# Altium schematic sheet STM32H733_PINOUT.SchDoc
size C; SheetNumber: 4; SheetTotal: 5
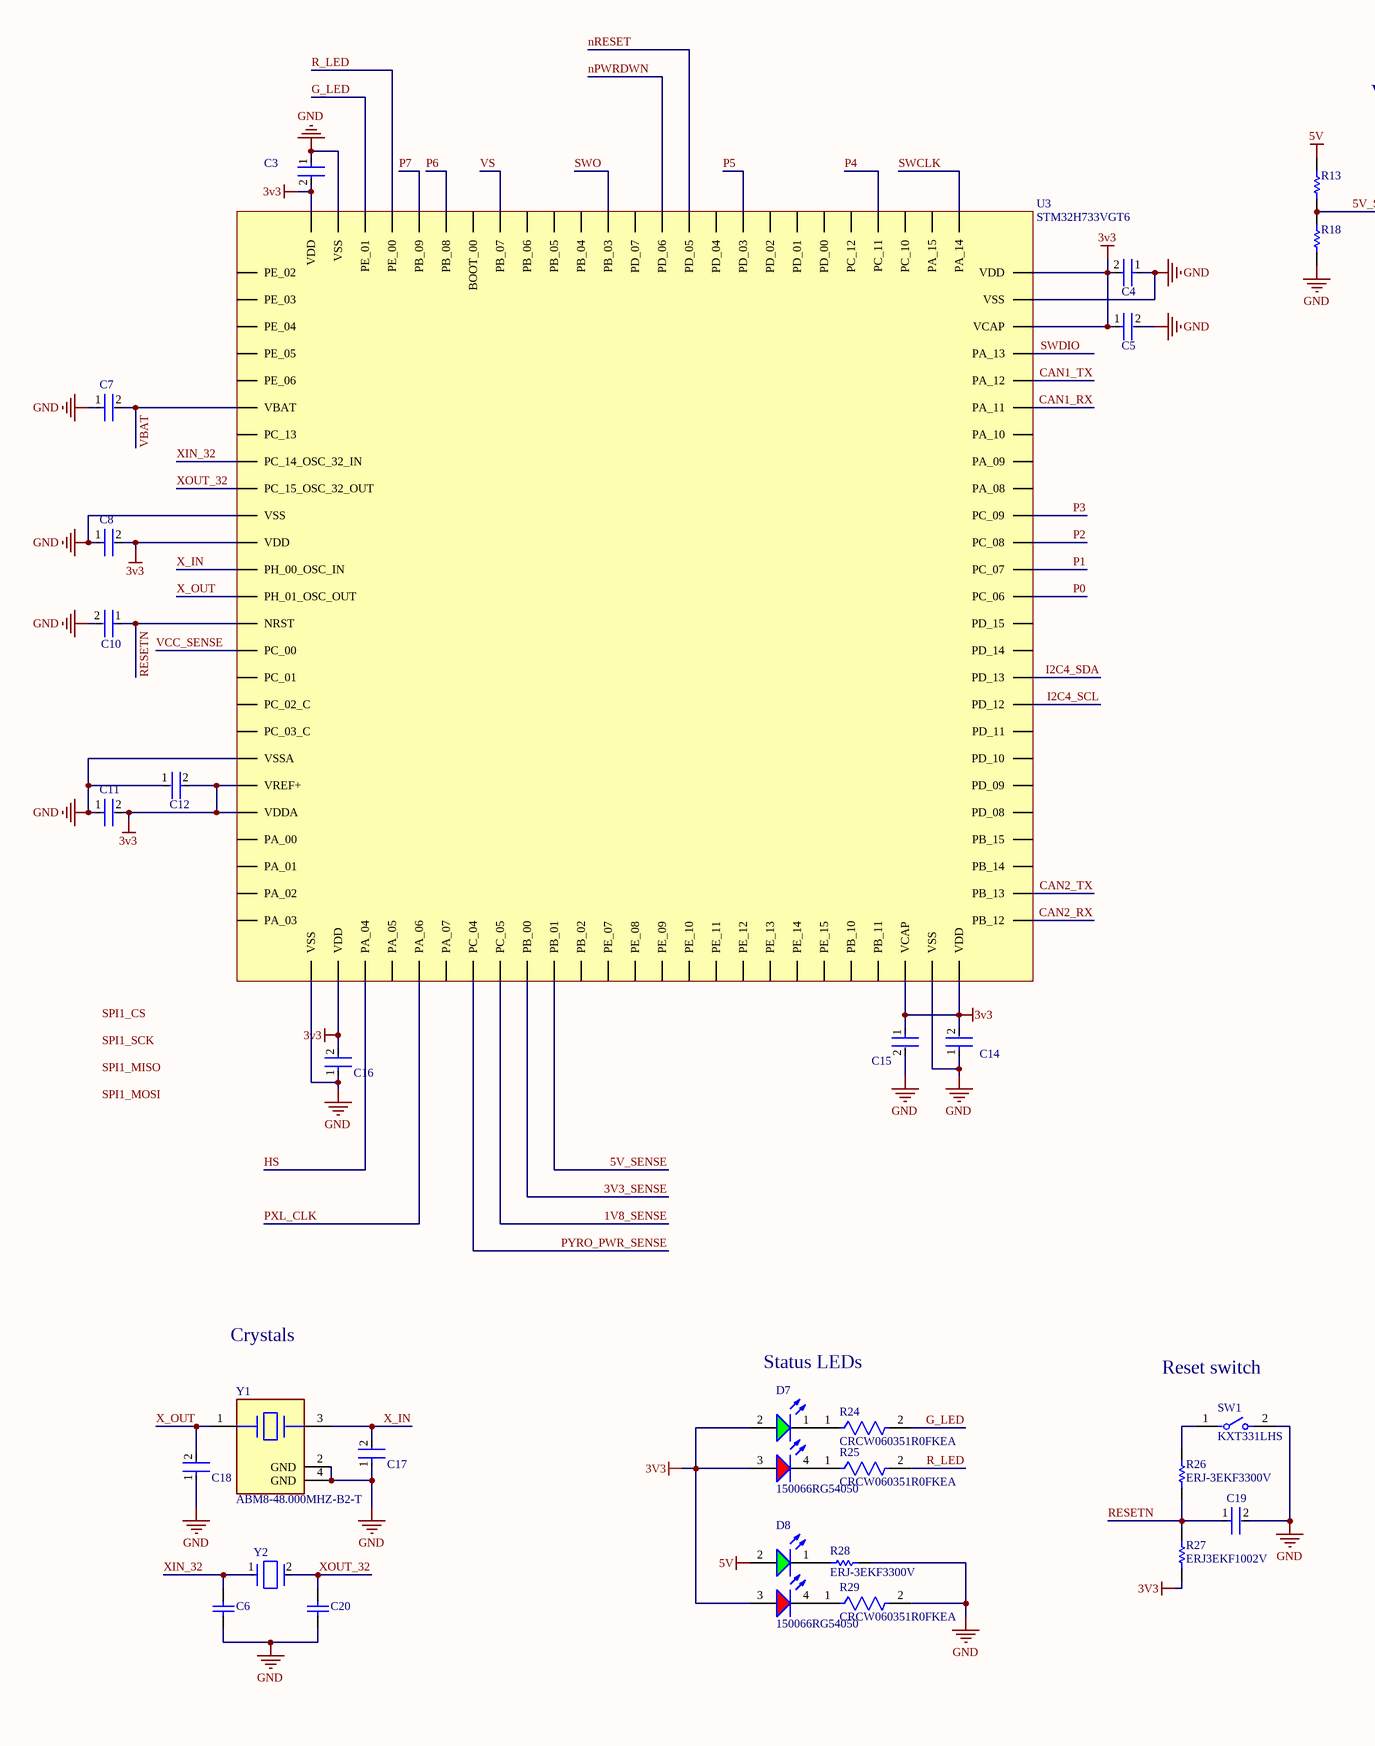
[diagram p0: STM32H733_PINOUT.SchDoc, left]
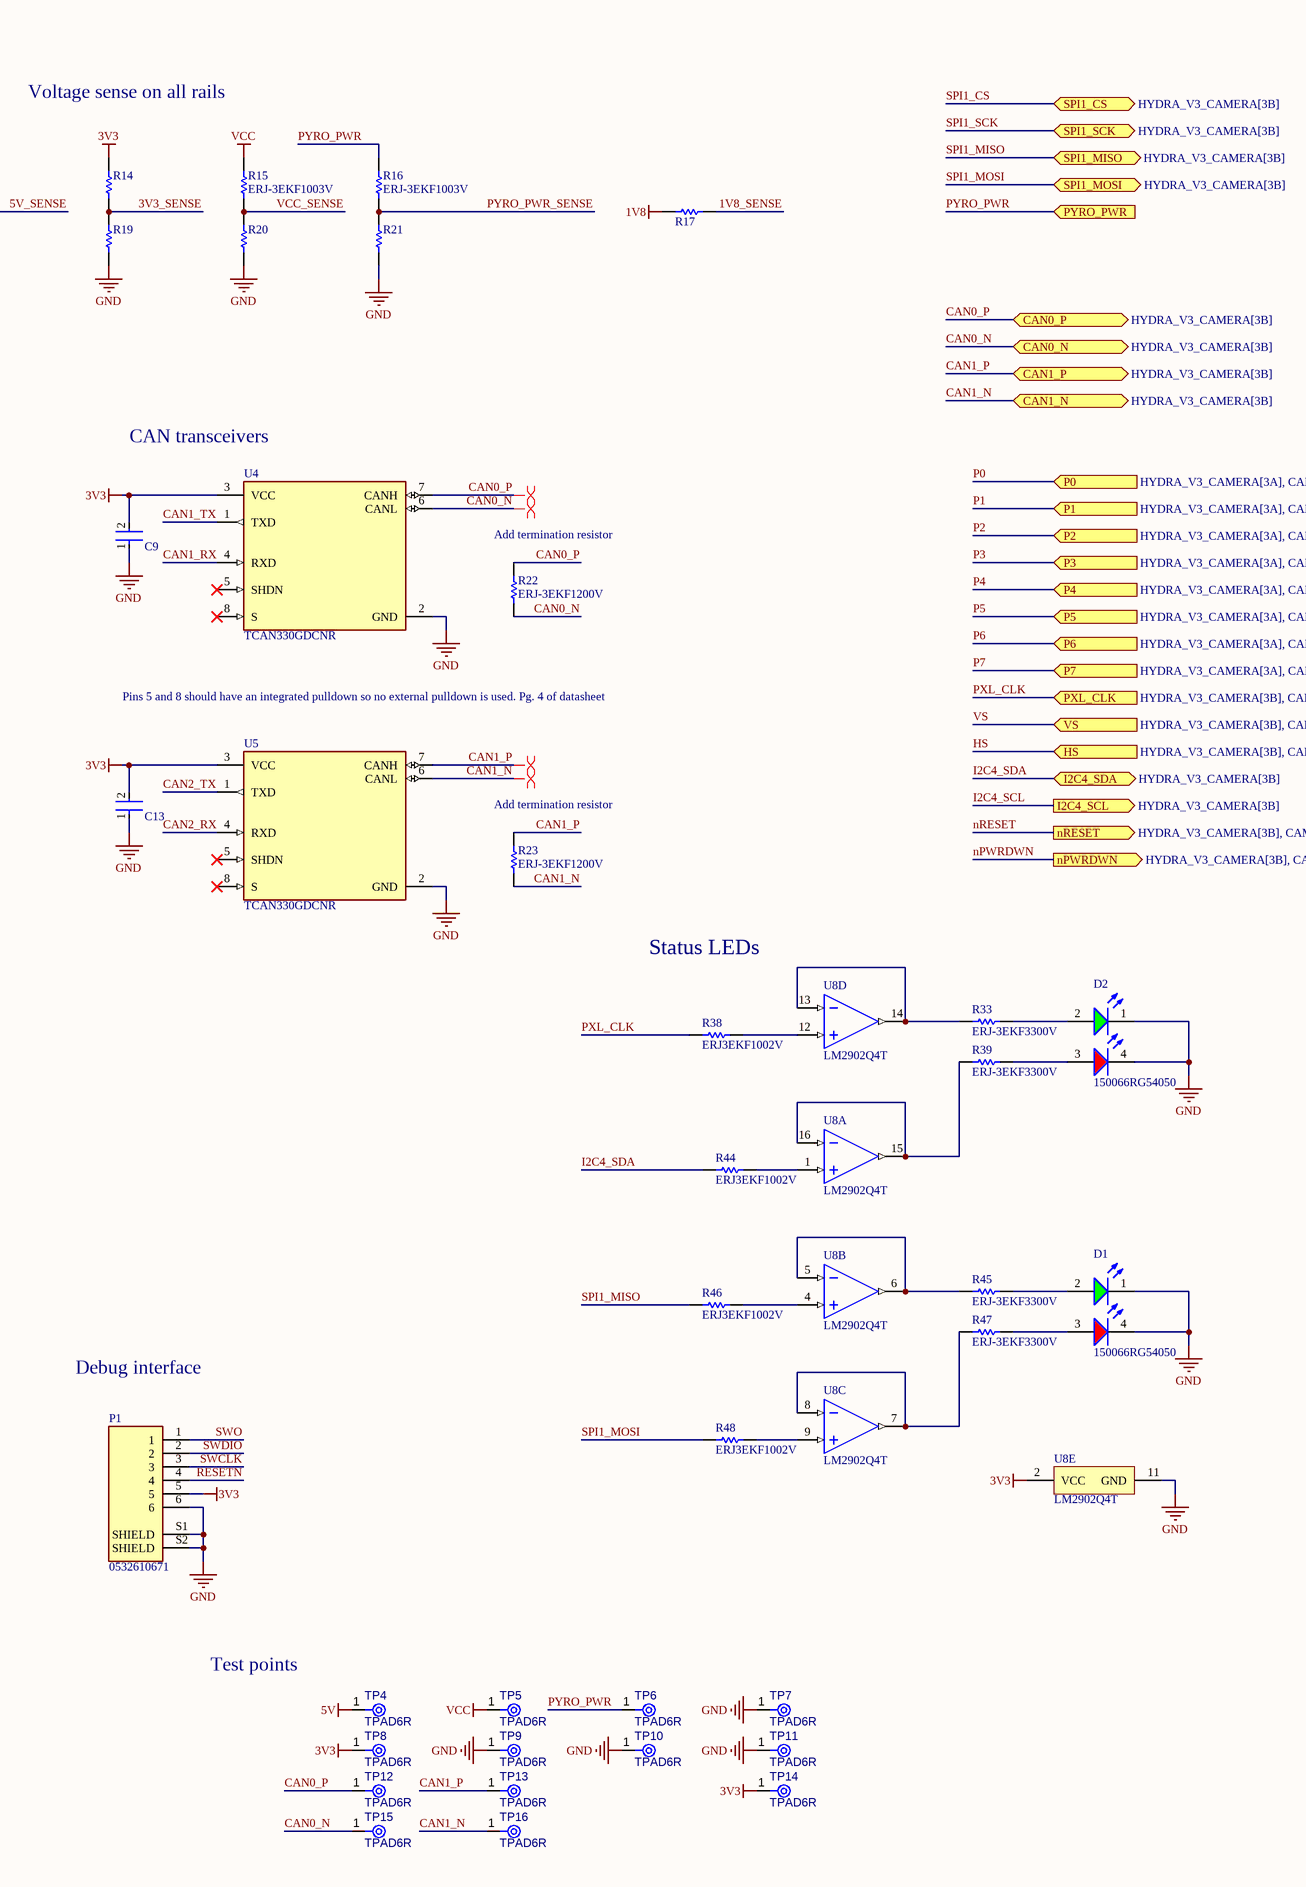
[diagram p1: STM32H733_PINOUT.SchDoc, right]

## Parts
C3  CC0402JRNPO9BN500  [FP-C0402-BB-MFG]  (value not drawn)
C4  CC0402JRNPO9BN500  [FP-C0402-BB-MFG]  (value not drawn)
C5  C1005X7S1A225K050BC  [FP-C1005-050-0_15-0_1-MFG]  (value not drawn)
C6  CC0603JRNPO9BN180  [CAPC1608X90X40LL10T20]  (value not drawn)
C7  CC0402JRNPO9BN500  [FP-C0402-BB-MFG]  (value not drawn)
C8  CC0402JRNPO9BN500  [FP-C0402-BB-MFG]  (value not drawn)
C9  C0402C104K8PACTU  [FP-C0402-BB-MFG]  (value not drawn)
C10  C0402C104K8PACTU  [FP-C0402-BB-MFG]  (value not drawn)
C11  CC0402JRNPO9BN500  [FP-C0402-BB-MFG]  (value not drawn)
C12  GRM155R71C104KA88D  [FP-GRM15-MFG]  (value not drawn)
C13  C0402C104K8PACTU  [FP-C0402-BB-MFG]  (value not drawn)
C14  CC0402JRNPO9BN500  [FP-C0402-BB-MFG]  (value not drawn)
C15  C1005X7S1A225K050BC  [FP-C1005-050-0_15-0_1-MFG]  (value not drawn)
C16  CC0402JRNPO9BN500  [FP-C0402-BB-MFG]  (value not drawn)
C17  08051A6R8CAT2A  [FP-0805-L_2_01_0_2-W_1_25-MFG]  (value not drawn)
C18  08051A6R8CAT2A  [FP-0805-L_2_01_0_2-W_1_25-MFG]  (value not drawn)
C19  C0402C104K8PACTU  [FP-C0402-BB-MFG]  (value not drawn)
C20  CC0603JRNPO9BN180  [CAPC1608X90X40LL10T20]  (value not drawn)
D1  150066RG54050  [WL-SBCD_0606]
D2  150066RG54050  [WL-SBCD_0606]
D7  150066RG54050  [WL-SBCD_0606]
D8  150066RG54050  [WL-SBCD_0606]
P1  0532610671  [0532610671-Footprint-1]
R13  ERJ3EKF1002V  [RESC1609X55X30LL15T15]  (value not drawn)
R14  ERJ3EKF1002V  [RESC1609X55X30LL15T15]  (value not drawn)
R15  ERJ-3EKF1003V  [RESC1608X55X30ML15T15]
R16  ERJ-3EKF1003V  [RESC1608X55X30ML15T15]
R17  ERJ3EKF1002V  [RESC1609X55X30LL15T15]  (value not drawn)
R18  ERJ3EKF1002V  [RESC1609X55X30LL15T15]  (value not drawn)
R19  ERJ3EKF1002V  [RESC1609X55X30LL15T15]  (value not drawn)
R20  ERJ3EKF1002V  [RESC1609X55X30LL15T15]  (value not drawn)
R21  ERJ3EKF1002V  [RESC1609X55X30LL15T15]  (value not drawn)
R22  ERJ-3EKF1200V  [RESC1609X55X30ML15T15]
R23  ERJ-3EKF1200V  [RESC1609X55X30ML15T15]
R24  CRCW060351R0FKEA  [FP-CRCW0603-e3-MFG]
R25  CRCW060351R0FKEA  [FP-CRCW0603-e3-MFG]
R26  ERJ-3EKF3300V  [RESC1608X55X30LL15T15]
R27  ERJ3EKF1002V  [RESC1609X55X30LL15T15]
R28  ERJ-3EKF3300V  [RESC1608X55X30LL15T15]
R29  CRCW060351R0FKEA  [FP-CRCW0603-e3-MFG]
R33  ERJ-3EKF3300V  [RESC1608X55X30LL15T15]
R38  ERJ3EKF1002V  [RESC1609X55X30LL15T15]
R39  ERJ-3EKF3300V  [RESC1608X55X30LL15T15]
R44  ERJ3EKF1002V  [RESC1609X55X30LL15T15]
R45  ERJ-3EKF3300V  [RESC1608X55X30LL15T15]
R46  ERJ3EKF1002V  [RESC1609X55X30LL15T15]
R47  ERJ-3EKF3300V  [RESC1608X55X30LL15T15]
R48  ERJ3EKF1002V  [RESC1609X55X30LL15T15]
SW1  KXT331LHS  [FP-KXT331LHS-MFG]
TP4  TPAD6R  [TP06R]  (no BOM)
TP5  TPAD6R  [TP06R]  (no BOM)
TP6  TPAD6R  [TP06R]  (no BOM)
TP7  TPAD6R  [TP06R]  (no BOM)
TP8  TPAD6R  [TP06R]  (no BOM)
TP9  TPAD6R  [TP06R]  (no BOM)
TP10  TPAD6R  [TP06R]  (no BOM)
TP11  TPAD6R  [TP06R]  (no BOM)
TP12  TPAD6R  [TP06R]  (no BOM)
TP13  TPAD6R  [TP06R]  (no BOM)
TP14  TPAD6R  [TP06R]  (no BOM)
TP15  TPAD6R  [TP06R]  (no BOM)
TP16  TPAD6R  [TP06R]  (no BOM)
U3  STM32H733VGT6  [STM32H733VGT6-Footprint-1]
U4  TCAN330GDCNR  [FP-DCN0008A-MFG]
U5  TCAN330GDCNR  [FP-DCN0008A-MFG]
U8  LM2902Q4T  [LM2902Q4T-Footprint-1]  (parts A,B,C,D,E of 5)
Y1  ABM8-48.000MHZ-B2-T  [FP-ABM8-MFG]
Y2  ECS-.327-12.5-1210-TR  [FP-ECX-1210-MFG]  (value not drawn)

## Ports
CAN0_N (bidir, see HYDRA_V3_CAMERA[3B]), CAN0_P (bidir, see HYDRA_V3_CAMERA[3B]), CAN1_N (bidir, see HYDRA_V3_CAMERA[3B]), CAN1_P (bidir, see HYDRA_V3_CAMERA[3B]), HS (in, see HYDRA_V3_CAMERA[3B], CAMERA_INTERFACE[6B]), I2C4_SCL (out, see HYDRA_V3_CAMERA[3B]), I2C4_SDA (bidir, see HYDRA_V3_CAMERA[3B]), nPWRDWN (out, see HYDRA_V3_CAMERA[3B], CAMERA_INTERFACE[6A]), nRESET (out, see HYDRA_V3_CAMERA[3B], CAMERA_INTERFACE[6A]), P0 (in, see HYDRA_V3_CAMERA[3A], CAMERA_INTERFACE[6B]), P1 (in, see HYDRA_V3_CAMERA[3A], CAMERA_INTERFACE[6B]), P2 (in, see HYDRA_V3_CAMERA[3A], CAMERA_INTERFACE[6B]), P3 (in, see HYDRA_V3_CAMERA[3A], CAMERA_INTERFACE[6B]), P4 (in, see HYDRA_V3_CAMERA[3A], CAMERA_INTERFACE[6B]), P5 (in, see HYDRA_V3_CAMERA[3A], CAMERA_INTERFACE[6B]), P6 (in, see HYDRA_V3_CAMERA[3A], CAMERA_INTERFACE[6B]), P7 (in, see HYDRA_V3_CAMERA[3A], CAMERA_INTERFACE[6B]), PXL_CLK (in, see HYDRA_V3_CAMERA[3B], CAMERA_INTERFACE[6B]), PYRO_PWR (in, see HYDRA_V3_CAMERA[3B]), SPI1_CS (bidir, see HYDRA_V3_CAMERA[3B]), SPI1_MISO (bidir, see HYDRA_V3_CAMERA[3B]), SPI1_MOSI (bidir, see HYDRA_V3_CAMERA[3B]), SPI1_SCK (bidir, see HYDRA_V3_CAMERA[3B]), VS (in, see HYDRA_V3_CAMERA[3B], CAMERA_INTERFACE[6B])

## Nets
1V8: R17.2
3v3: C3.2 C4.2 C5.1 C8.2 C9.2 C11.2 C12.2 C13.2 C14.2 C15.1 C16.2 D7.2(A) D7.3(A) D8.3(A) P1.5 R14.2 R27.1 TP8.1(TP) TP14.1(TP) U3.11(VDD) U3.20(VREF+) U3.21(VDDA) U3.27(VDD) U3.48(VCAP) U3.50(VDD) U3.73(VCAP) U3.75(VDD) U3.100(VDD) U4.3(VCC) U5.3(VCC) U8.2(VCC)
5V: D8.2(A) R13.2 TP4.1(TP)
GND: C3.1 C4.1 C5.2 C6.1 C7.1 C8.1 C9.1 C10.2 C11.1 C12.1 C13.1 C14.1 C15.2 C16.1 C17.1 C18.1 C19.2 C20.1 D1.1(K) D1.4(K) D2.1(K) D2.4(K) P1.6 P1.S1(SHIELD) P1.S2(SHIELD) R18.1 R19.1 R20.1 R21.1 R28.2 R29.2 SW1.2 TP7.1(TP) TP9.1(TP) TP10.1(TP) TP11.1(TP) U3.10(VSS) U3.19(VSSA) U3.26(VSS) U3.49(VSS) U3.74(VSS) U3.99(VSS) U4.2(GND) U5.2(GND) U8.11(GND) Y1.2(GND) Y1.4(GND)
VCC: R15.2 TP5.1(TP)
1V8_SENSE: R17.1 U3.33(PC_05)
3V3_SENSE: R14.1 R19.2 U3.34(PB_00)
5V_SENSE: R13.1 R18.2 U3.35(PB_01)
CAN0_N: R22.1 TP15.1(TP) U4.6(CANL) ; port CAN0_N
CAN0_P: R22.2 TP12.1(TP) U4.7(CANH) ; port CAN0_P
CAN1_N: R23.1 TP16.1(TP) U5.6(CANL) ; port CAN1_N
CAN1_P: R23.2 TP13.1(TP) U5.7(CANH) ; port CAN1_P
CAN1_RX: U3.70(PA_11) U4.4(RXD)
CAN1_TX: U3.71(PA_12) U4.1(TXD)
CAN2_RX: U3.51(PB_12) U5.4(RXD)
CAN2_TX: U3.52(PB_13) U5.1(TXD)
G_LED: R24.2 U3.98(PE_01)
HS: U3.28(PA_04) ; port HS
I2C4_SCL: U3.59(PD_12) ; port I2C4_SCL
I2C4_SDA: R44.2 U3.60(PD_13) ; port I2C4_SDA
nPWRDWN: U3.87(PD_06) ; port nPWRDWN
nRESET: U3.86(PD_05) ; port nRESET
P0: U3.63(PC_06) ; port P0
P1: U3.64(PC_07) ; port P1
P2: U3.65(PC_08) ; port P2
P3: U3.66(PC_09) ; port P3
P4: U3.79(PC_11) ; port P4
P5: U3.84(PD_03) ; port P5
P6: U3.95(PB_08) ; port P6
P7: U3.96(PB_09) ; port P7
PXL_CLK: R38.1 U3.30(PA_06) ; port PXL_CLK
PYRO_PWR: R16.2 TP6.1(TP) ; port PYRO_PWR
PYRO_PWR_SENSE: R16.1 R21.2 U3.32(PC_04)
R_LED: R25.2 U3.97(PE_00)
RESETN: C10.1 C19.1 P1.4 R26.1 R27.2 U3.14(NRST)
SPI1_CS: port SPI1_CS
SPI1_MISO: R46.1 ; port SPI1_MISO
SPI1_MOSI: R48.2 ; port SPI1_MOSI
SPI1_SCK: port SPI1_SCK
SWCLK: P1.3 U3.76(PA_14)
SWDIO: P1.2 U3.72(PA_13)
SWO: P1.1 U3.89(PB_03)
VBAT: C7.2 U3.6(VBAT)
VCC_SENSE: R15.1 R20.2 U3.15(PC_00)
VS: U3.93(PB_07) ; port VS
X_IN: C17.2 U3.12(PH_00_OSC_IN) Y1.3
X_OUT: C18.2 U3.13(PH_01_OSC_OUT) Y1.1
XIN_32: C6.2 U3.8(PC_14_OSC_32_IN) Y2.1(In/Out)
XOUT_32: C20.2 U3.9(PC_15_OSC_32_OUT) Y2.2(Out/In)
NetD1_2: D1.2(A) R45.2
NetD1_3: D1.3(A) R47.2
NetD2_2: D2.2(A) R33.2
NetD2_3: D2.3(A) R39.2
NetD7_1: D7.1(K) R24.1
NetD7_4: D7.4(K) R25.1
NetD8_1: D8.1(K) R28.1
NetD8_4: D8.4(K) R29.1
NetR26_2: R26.2 SW1.1
NetR33_1: R33.1 U8.13(4IN-) U8.14(4OUT)
NetR38_2: R38.2 U8.12(4IN+)
NetR39_1: R39.1 U8.15(1OUT) U8.16(1IN-)
NetR44_1: R44.1 U8.1(1IN+)
NetR45_1: R45.1 U8.5(2IN-) U8.6(2OUT)
NetR46_2: R46.2 U8.4(2IN+)
NetR47_1: R47.1 U8.7(3OUT) U8.8(3IN-)
NetR48_1: R48.1 U8.9(3IN+)

Not connected (* = marked no-connect by the designer): U3 1(PE_02) 2(PE_03) 3(PE_04) 4(PE_05) 5(PE_06) 7(PC_13) 16(PC_01) 17(PC_02_C) 18(PC_03_C) 22(PA_00) 23(PA_01) 24(PA_02) 25(PA_03) 29(PA_05) 31(PA_07) 36(PB_02) 37(PE_07) 38(PE_08) 39(PE_09) 40(PE_10) 41(PE_11) 42(PE_12) 43(PE_13) 44(PE_14) 45(PE_15) 46(PB_10) 47(PB_11) 53(PB_14) 54(PB_15) 55(PD_08) 56(PD_09) 57(PD_10) 58(PD_11) 61(PD_14) 62(PD_15) 67(PA_08) 68(PA_09) 69(PA_10) 77(PA_15) 78(PC_10) 80(PC_12) 81(PD_00) 82(PD_01) 83(PD_02) 85(PD_04) 88(PD_07) 90(PB_04) 91(PB_05) 92(PB_06) 94(BOOT_00); U4 5(SHDN)* 8(S)*; U5 5(SHDN)* 8(S)*

## Layout directives
differential pair: CAN0_N, CAN0_P, CAN1_N, CAN1_P

## Notes on the sheet
- Voltage sense on all rails
- (near U4) CAN transceivers
- (near R22) Add termination resistor
- Pins 5 and 8 should have an integrated pulldown so no external pulldown is used. Pg. 4 of datasheet
- (near R23) Add termination resistor
- Status LEDs
- Crystals
- (near SW1) Reset switch
- Debug interface
- Test points
- Labels drawn without touching a wire or pin: SPI1_CS, SPI1_MISO, SPI1_MOSI, SPI1_SCK

## Library data of the parts
C3 C4 C7 C8 C11 C14 C16 = CMP-2008-02046-2: Actually CC0402JRNPO9BN500; Manufacturer: Kemet; Manufacturer Part Number: C0402C104K8PACTU; Material: Ceramic; Capacitance: 50 pF; Temperature Characteristic: X5R; Temperature Coefficient: 15%; Tolerance: 0.1; Voltage Rating: 10 V; Value: 50 pF; Package: C0402-BB; Temperature: -55°C to +125°C; ComponentLink2Description: Datasheet; Device Class L1: Passive Components; Height: 0.55mm; Lead Free: Yes; ComponentLink2URL: https://content.kemet.com/datasheets/KEM_C1002_X7R_SMD.pdf; Device Class L2: Capacitors; Temperature Range Low: -55°C; Temperature Range High: +125°C; RoHS: TRUE; Octopart: https://octopart.com/c0402c104k8pactu-kemet-140039; Automotive: No; Mouser Description: Capacitor 100 nF 10 VDC 0402; Category: Cap; Digikey Description: CAP CER 0.1UF 10V X5R 0402; Ipc Land Pattern Name: CAPC10050X50; Device Class L3: Ceramic Capacitors
C5 C15 = CMP-08246-004344-1: CAP CER 2.2UF 10V X7S 0402; Dielectric Material: Ceramic; Tolerance: 10%; Mount: Surface Mount; Height: 0.5mm; Package Quantity: 1; Depth: 0.5mm; RoHS Compliant: Yes; Length: 1mm; Thickness: 0.022inch; Packaging: Tape and Reel; Capacitance: 2.2uF; Case Code (Imperial): 0402; Resistor Type: Ceramic; Dielectric: X7S; Case/Package: 0402; Min Operating Temperature: -55°C; Voltage Rating: 10V; Series: C; Weight: 2.3E-05oz; Width: 0.02inch; Voltage Rating (DC): 10V; Case Code (Metric): 1005; Max Operating Temperature: 125°C; Termination: SMD/SMT; Lead Free: Lead Free
C6 C20 = CMP-1659-00030-1: Chip Capacitor, 18 pF, +/- 5%, 50 V, -55 to 125 degC, 0603 (1608 Metric), RoHS, Tape and Reel; Voltage Rating: 50 V; Case\Package: 0603; Power Rating: 100 mW; Resistance: 68.1 Ohm; Tolerance: 1%; Case Code (Metric): 1608; Max Operating Temperature: 155 degC; RoHSCompliant: true; Case Code (Imperial): 0603; ComponentLink2Description: Datasheet; Package Quantity: 200; PackageReference: 0603; ComponentLink2URL: http://www.yageo.com/NewPortal/yageodocoutput?fileName=/pdf/MLCC/UPY-GP_NP0_16V-to-50V_14.pdf; Length: 1.6 mm; DatasheetVersion: Rev. 14, 07/2016; Min Operating Temperature: -55 degC; ComponentLink1URL: http://www.yageo.com/; Width: 0.8 mm; ComponentLink1Description: Manufacturer URL; Height: 0.45 mm; Radiation Hardening: No; PackageDescription: 2-Pin Surface Mount Device, Body 1.6 x 0.8 mm; Packaging: Tape and Reel
C9 C10 C13 C19 = CMP-2008-02046-2: CAP CER 0.1UF 10V X5R 0402; Manufacturer: Kemet; Material: Ceramic; Capacitance: 0.10 μF; Temperature Coefficient: 15%; Tolerance: 0.1; Value: 0.10 μF; Package: C0402-BB; Temperature: -55°C to +125°C; ComponentLink2Description: Datasheet; Temperature Characteristic: X5R; Device Class L1: Passive Components; Height: 0.55mm; Lead Free: Yes; ComponentLink2URL: https://content.kemet.com/datasheets/KEM_C1002_X7R_SMD.pdf; Device Class L2: Capacitors; Temperature Range Low: -55°C; Temperature Range High: +125°C; RoHS: TRUE; Octopart: https://octopart.com/c0402c104k8pactu-kemet-140039; Automotive: No; Mouser Description: Capacitor 100 nF 10 VDC 0402; Category: Cap; Voltage Rating: 10 V; Digikey Description: CAP CER 0.1UF 10V X5R 0402; Ipc Land Pattern Name: CAPC10050X50; Device Class L3: Ceramic Capacitors; Manufacturer Part Number: C0402C104K8PACTU
C12 = CMP-2100-03641-2: CAP CER 0.1UF 16V X7R 0402; Manufacturer: Murata; Standoff Height: 0mm; Tolerance: 10%; Voltage Rating: 16Vdc; Material: Ceramic; Capacitance: 0.10μF; Value: 0.10μF; RoHS: TRUE; Manufacturer Part Number: GRM155R71C104KA88D; Temperature Characteristic: X7R; Octopart: https://octopart.com/grm155r71c104ka88d-murata-196880; Digikey Description: CAP CER 0.1UF 16V X7R 0402; Device Class L3: Ceramic Capacitors; Height: 0.55mm; ComponentLink2Description: Datasheet; Temperature Range Low: -55°C; Ipc Land Pattern Name: CAPC10050X219; ComponentLink2URL: https://search.murata.co.jp/Ceramy/image/img/A01X/G101/ENG/GRM155R71H471KA01-01A.pdf; Device Class L1: Passive Components; Lead Free: yes; Category: Cap; Package: GRM15; Temperature: -55°C to +125°C; Device Class L2: Capacitors; Temperature Range High: +125°C; Mouser Description: 0402 0.1 uF 16V ±10 % Tolerance X7R SMT Multilayer Ceramic Capacitor
C17 C18 = CMP-1036-00709-3: General Purpose Ceramic Capacitor, 0805, 6.8pF, 0.25pF, C0G, 30ppm/°C, 100V; Dissipation Factor: 10%; Insulation Resistance: 100GR; Tolerance: 5%; Max Operating Temperature: 125°C; RoHS Compliant: Yes; Capacitance: 6.8pF; Termination: SMD/SMT; Number of Pins: 2; Packaging: Tape and Reel; Mount: Surface Mount; Case Code (Metric): 2012; Case Code (Imperial): 0805; Height: 0.71mm; Min Operating Temperature: -55°C; Width: 0.049inch; Temperature Coefficient: 0ppm/°C; Length: 2.01mm; Dielectric: C0G; Series: -; Voltage Rating (DC): 100V; Dielectric Material: Ceramic; Depth: 1.25mm; Contact Plating: Tin; Voltage Rating: 100V; Thickness: 0.037inch; Case/Package: 0805; Lead Free: Lead Free; Radiation Hardening: No; Voltage: 100V; Construction: Flat; Package Quantity: 1; REACH SVHC: No SVHC
D1 D2 D7 D8 = CMP-004-00034-2: Led, Red/Grn, 180Mcd/230Mcd, 624Nm/525Nm Rohs Compliant: Yes
P1 = CMP-002-00079-1: Conn Shrouded Header (4 Sides) HDR 6 POS 1.25mm Solder RA Side Entry SMD PicoBlade™ T/R
R13 R14 R17-R21 R27 R38 R44 R46 R48 = CMP-1012-00623-3: Chip Resistor, 10 KOhm, +/- 1%, 0.1 W, -55 to 155 degC, 0603 (1608 Metric), RoHS, Tape and Reel; Manufacturer: Panasonic; Voltage Rating: 75V; Case\/Package: 0603; Power Rating: 100mW; Resistance: 10KOhm; Temperature Coefficient: 100ppm\/degreesC; Number of Pins: 2; Package Reference: 603; Depth: 0.8mm; Mount: SurfaceMount; Package Description: 2-Pin Surface Mount Device, Body 1.6 x 0.85 mm; Datasheet Version: 02/2017; Length: 1.6mm; Lead Free: LeadFree; Height: 0.45mm; Number of Terminations: 2; Max Power Dissipation: 100mW; Min Operating Temperature: -55degC; Datasheet URL: https://industrial.panasonic.com/cdbs/www-data/pdf/RDA0000/AOA0000C304.pdf; Termination: SMD/SMT; Case Code (Metric): 1608; Case Code (Imperial): 0603; Tolerance: 1%; Max Operating Temperature: 155degC; RoHSCompliant: true; Voltage Rating (DC): 75V; Radiation Hardening: No; Packaging: TapeandReel; Composition: ThickFilm; Mounting Technology: SurfaceMount; Manufacturer URL: http://www.panasonic.com/; Width: 0.031inch; REACH SVHC: NoSVHC; Contact Plating: Tin; Military Standard: Not; Package Quantity: 1
R15 R16 = CMP-2000-00182-1: Manufacturer: Panasonic; Part Number: ERJ-3EKF1003V
R22 R23 = CMP-2000-00213-2: Chip Resistor, 120 Ohm, +/- 1%, 0.1 W, -55 to 155 degC, 0603 (1608 Metric), RoHS, Tape and Reel; Manufacturer: Panasonic; Power Rating: 100mW; Voltage Rating (DC): 75V; Resistance: 120Ohm; Temperature Coefficient: 100ppm/degreesC; Number of Terminations: 2; Military Standard: Not; Tolerance: 1%; Min Operating Temperature: -55degC; Packaging: TapeandReel; Lead Free: LeadFree; Max Operating Temperature: 155degC; Manufacturer URL: http://www.panasonic.com/; Case Code (Imperial): 0603; REACH SVHC: NoSVHC; Width: 0.031inch; Datasheet URL: https://industrial.panasonic.com/cdbs/www-data/pdf/RDA0000/AOA0000C283.pdf; RoHSCompliant: true; Max Power Dissipation: 100mW; Termination: SMD/SMT; Package Reference: 0603; Height: 0.022inch; Depth: 0.8mm; Package Description: 2-Pin Surface Mount Device, Body 1.6 x 0.85 mm; Contact Plating: Tin; Length: 1.6mm; Package URL: http://www.st.com/st-web-ui/static/active/en/resource/technical/document/datasheet/CD00001320.pdf; Radiation Hardening: No; Package Quantity: 1; Number of Pins: 2; Datasheet Version: 42095.0; Voltage Rating: 75V; Composition: ThickFilm; Case/Package: 0603; Mount: SurfaceMount; Case Code (Metric): 1608
R24 R25 R29 = CMP-2000-03446-2: RES Thick Film, 51Ω, 1%, 0.1W, 100ppm/°C, 0603; Power Rating: 100mW; Voltage Rating: 75V; Resistance: 51R; Military Standard: Not; Case Code (Imperial): 0603; Max Operating Temperature: 155°C; Temperature Coefficient: 100ppm/°C; Lead Free: Lead Free; Weight: 7.1E-05oz; Number of Pins: 2; Package Quantity: 10; Case/Package: 0603; Termination: SMD/SMT; Min Operating Temperature: -55°C; Tolerance: 1%; Contact Plating: Tin; Height: 0.45mm; Working Voltage: 75V; Radiation Hardening: No; Packaging: Tape and Reel; Composition: Thick Film; Max Power Dissipation: 100mW; Width: 0.85mm; Depth: 0.85mm; Length: 1.55mm; Case Code (Metric): 1608; Voltage Rating (DC): 75V; Number of Terminations: 2; Features: Automotive AEC-Q200
R26 R28 R33 R39 R45 R47 = CMP-2000-00435-2: Chip Resistor, 330 Ohm, +/- 1%, 0.1 W, -55 to 155 degC, 0603 (1608 Metric), RoHS, Tape and Reel; Gender: Male; Mating Cycles: 10000; Current Rating: 500 mA; Voltage Rating: 10 V; REACH SVHC: No SVHC; PackageDescription: 2-Pin Surface Mount Device, Body 1.6 x 0.85 mm; Contact Finish: Gold; Pins: 8; ComponentLink1Description: Manufacturer URL; Packaging: Tape and Reel; Max Operating Temperature: 85 degC; Contact Material: Copper; Height: 1.45 mm; Width: 1.45 mm; DatasheetVersion: Apr-15; Package Quantity: 1500; Contact Plating: Gold; PackageReference: 0603; Mount: Surface Mount; Lead Pitch: 1.1 mm; Min Operating Temperature: -25 degC; ComponentLink1URL: http://www.panasonic.com/; ComponentLink2URL: http://industrial.panasonic.com/cdbs/www-data/pdf/RDA0000/AOA0000C86.pdf; Length: 13.7 mm; ComponentLink2Description: Datasheet; RoHSCompliant: true
SW1 = CMP-10040-000029-1: SWITCH TACTILE SPST-NO 0.02A 15V; Operating Force: 240gf; Switch Travel: 0.13mm; Illumination Type: Non-Illuminated; Throw Configuration: SPST; Number of Ports: 1; Current Rating: 5A; Mechanical Life: 500000Cycles; Switch Function: Off-Mom; Connector Type: USB; Actuator Type: Standard; Gender: Receptacle; Number of Contacts: 24; Contact Plating: Gold; Insulation Color: Black; Min Operating Temperature: -40°C; Packaging: Tape and Reel; Flammability Rating: UL94 V-0; Max Operating Temperature: 85°C; Termination: Solder; Mount: Surface Mount
TP4-TP16 = CMP-00028-00002-2: 0.6mm round; Pins: 1
U3 = CMP-020-00024-1: MCU 32-bit ARM Cortex M7 RISC 1MB Flash 1.8V/2.5V/3.3V 100-Pin LQFP Tray
U4 U5 = CMP-04872-000178-1: IC TRANSCEIVER 1/1 SOT23-8; Data Rate: 1Mbps; Packaging: Tape and Reel; Min Operating Temperature: -40°C; Max Operating Temperature: 125°C; RoHS Compliant: Yes; Lead Free: Lead Free; Case/Package: SOT-23-8; Mount: Surface Mount
U8 = CMP-014-00004-1: LM2902 Series 30 V 1.3 MHz Low-Power Quad Operational Amplifier - QFN-16 (3x3)
Y1 = CMP-27762-011708-1: Crystal 48MHz ±20ppm 18pF SMD-4 3.2mm x 2.5mm; Series Resistance: 35R; Frequency Stability: 50ppm; Package Quantity: 1000; Packaging: Tape and Reel; Mount: Surface Mount; Length: 3.2mm; Load Capacitance: 18pF; Max Operating Temperature: 70°C; Operating Frequency: 48 MHz; RoHS Compliant: Yes; Series: ABM8; Frequency Tolerance: 20ppm; Lead Free: Lead Free; Min Operating Temperature: -20°C; Case/Package: CSMD; Number of Pins: 4; Height: 0.031inch; ESR (Equivalent Series Resistance): 35R; Frequency: 48MHz; Radiation Hardening: No; Width: 0.098inch; Tolerance: 20ppm; Termination: SMD/SMT; Depth: 2.5mm; Resistor Type: Ceramic; REACH SVHC: No SVHC
Y2 = CMP-40224-000006-1: CRYSTAL 32.7680KHZ 12.5PF SMD; Manufacturer: ECS International; Frequency: 32.768kHz; Esr: 90kΩ; Tolerance: 20ppm; Device Class L1: Passive Components; Load Capacitance: 12.5pF; Temperature: -40°C to +85°C; ComponentLink2URL: https://ecsxtal.com/store/pdf/ECX-1210.pdf; Series: ECX-1210; Octopart: https://octopart.com/ecs-.327-12.5-1210-tr-ecs+international-81221340; ComponentLink2Description: Datasheet; Temperature Range Low: -40°C; Digikey Description: CRYSTAL 32.7680KHZ 12.5PF SMD; Lead Free: Yes; RoHS: TRUE; Device Class L3: Crystals; Automotive: No; Category: Crys; Height: 0.5mm; Manufacturer Part Number: ECS-.327-12.5-1210-TR; Temperature Range High: +85°C; Device Class L2: Crystals / Oscillators; Package: ECX-1210